# EAGLE design atmega1284_oled_v2 (EAGLE 7.1.0)
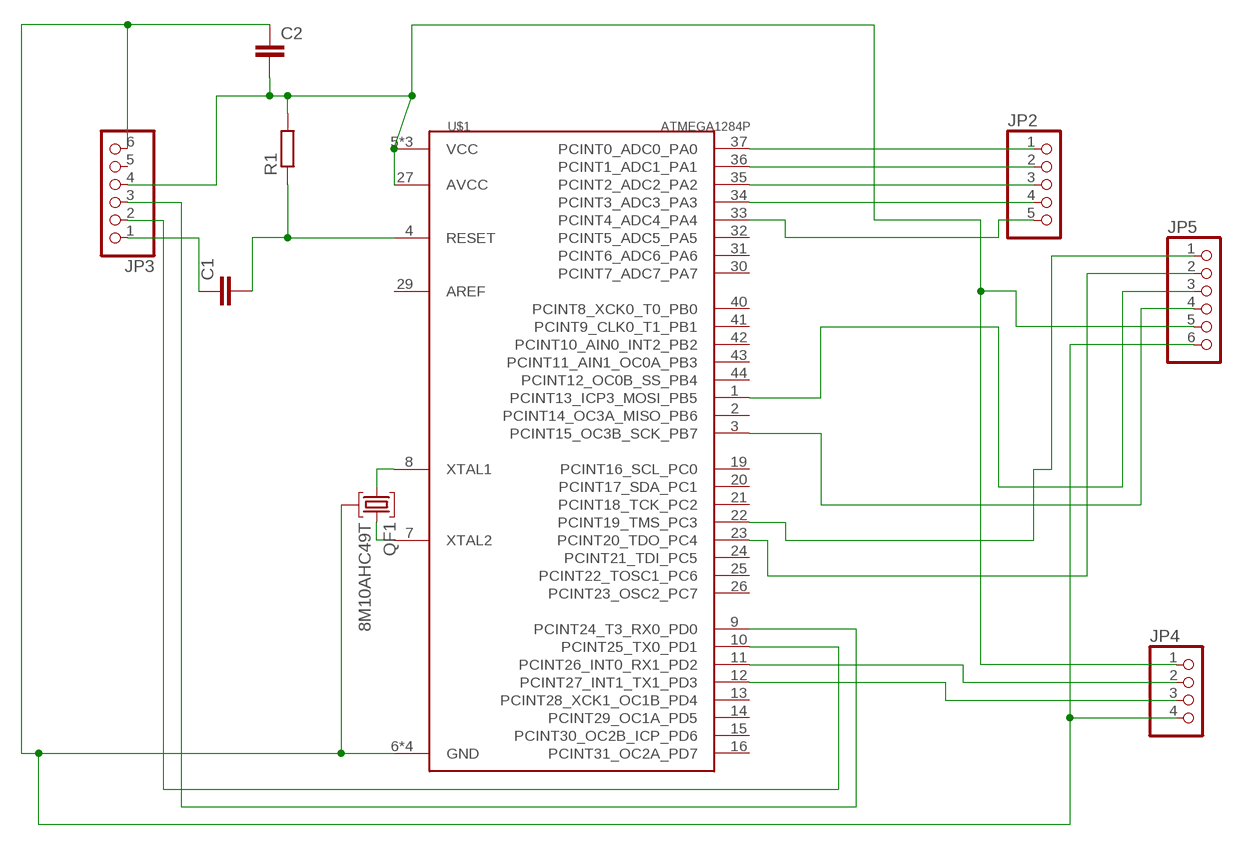
[diagram p0: schematic, sheet 1]

## Parts
C1  C-EUC0805  [C0805]
C2  C-EUC0805  [C0805]
JP2  PINHD-1X5  [1X05]
JP3  PINHD-1X6  [1X06]
JP4  PINHD-1X4  [1X04]
JP5  PINHD-1X6  [1X06]
QF1  8M10AHC49T  [HC49U]
R1  R-EU_R0805  [R0805]
U$1  ATMEGA1284P  [TQFP44]

## Nets
N$1: JP2.1 U$1.37(PCINT0_ADC0_PA0)
N$2: JP2.2 U$1.36(PCINT1_ADC1_PA1)
N$3: JP5.3 U$1.1(PCINT13_ICP3_MOSI_PB5)
N$4: C2.2 JP3.4 JP4.1 JP5.5 R1.2 U$1.5(VCC) U$1.17(VCC) U$1.27(AVCC) U$1.38(VCC)
N$5: QF1.1 U$1.8(XTAL1)
N$6: QF1.3 U$1.7(XTAL2)
N$7: C2.1 JP3.6 JP4.4 JP5.6 QF1.2 U$1.6(GND) U$1.18(GND) U$1.28(GND) U$1.39(GND)
N$8: JP5.4 U$1.3(PCINT15_OC3B_SCK_PB7)
N$9: JP4.2 U$1.11(PCINT26_INT0_RX1_PD2)
N$10: C1.2 R1.1 U$1.4(RESET)
N$11: C1.1 JP3.1
N$12: JP3.2 U$1.10(PCINT25_TX0_PD1)
N$13: JP3.3 U$1.9(PCINT24_T3_RX0_PD0)
N$14: JP5.1 U$1.22(PCINT19_TMS_PC3)
N$15: JP5.2 U$1.23(PCINT20_TDO_PC4)
N$16: JP4.3 U$1.12(PCINT27_INT1_TX1_PD3)
N$17: JP2.3 U$1.35(PCINT2_ADC2_PA2)
N$18: JP2.4 U$1.34(PCINT3_ADC3_PA3)
N$19: JP2.5 U$1.33(PCINT4_ADC4_PA4)
Unconnected: JP3.5 U$1.2(PCINT14_OC3A_MISO_PB6) U$1.13(PCINT28_XCK1_OC1B_PD4) U$1.14(PCINT29_OC1A_PD5) U$1.15(PCINT30_OC2B_ICP_PD6) U$1.16(PCINT31_OC2A_PD7) U$1.19(PCINT16_SCL_PC0) U$1.20(PCINT17_SDA_PC1) U$1.21(PCINT18_TCK_PC2) U$1.24(PCINT21_TDI_PC5) U$1.25(PCINT22_TOSC1_PC6) U$1.26(PCINT23_OSC2_PC7) U$1.29(AREF) U$1.30(PCINT7_ADC7_PA7) U$1.31(PCINT6_ADC6_PA6) U$1.32(PCINT5_ADC5_PA5) U$1.40(PCINT8_XCK0_T0_PB0) U$1.41(PCINT9_CLK0_T1_PB1) U$1.42(PCINT10_AIN0_INT2_PB2) U$1.43(PCINT11_AIN1_OC0A_PB3) U$1.44(PCINT12_OC0B_SS_PB4)

## Library data of the parts
C1 C2 = rcl:C-EU: CAPACITOR, European symbol
JP2 = pinhead:PINHD-1X5: PIN HEADER
JP3 JP5 = pinhead:PINHD-1X6: PIN HEADER
JP4 = pinhead:PINHD-1X4: PIN HEADER
QF1 = crystal:8M10AHC49T: Monolithic Crystal Filters Source: www.vanlong.com; OC_FARNELL: unknown; OC_NEWARK: unknown
R1 = rcl:R-EU_: RESISTOR, European symbol
U$1 = Stephanie_Parts:ATMEGA1284P: My version schematic & footprint for the ATMega1284P TQFP-44 package. Matches digikey part ATMEGA1284P-AU-ND. Tested & working.

## Board
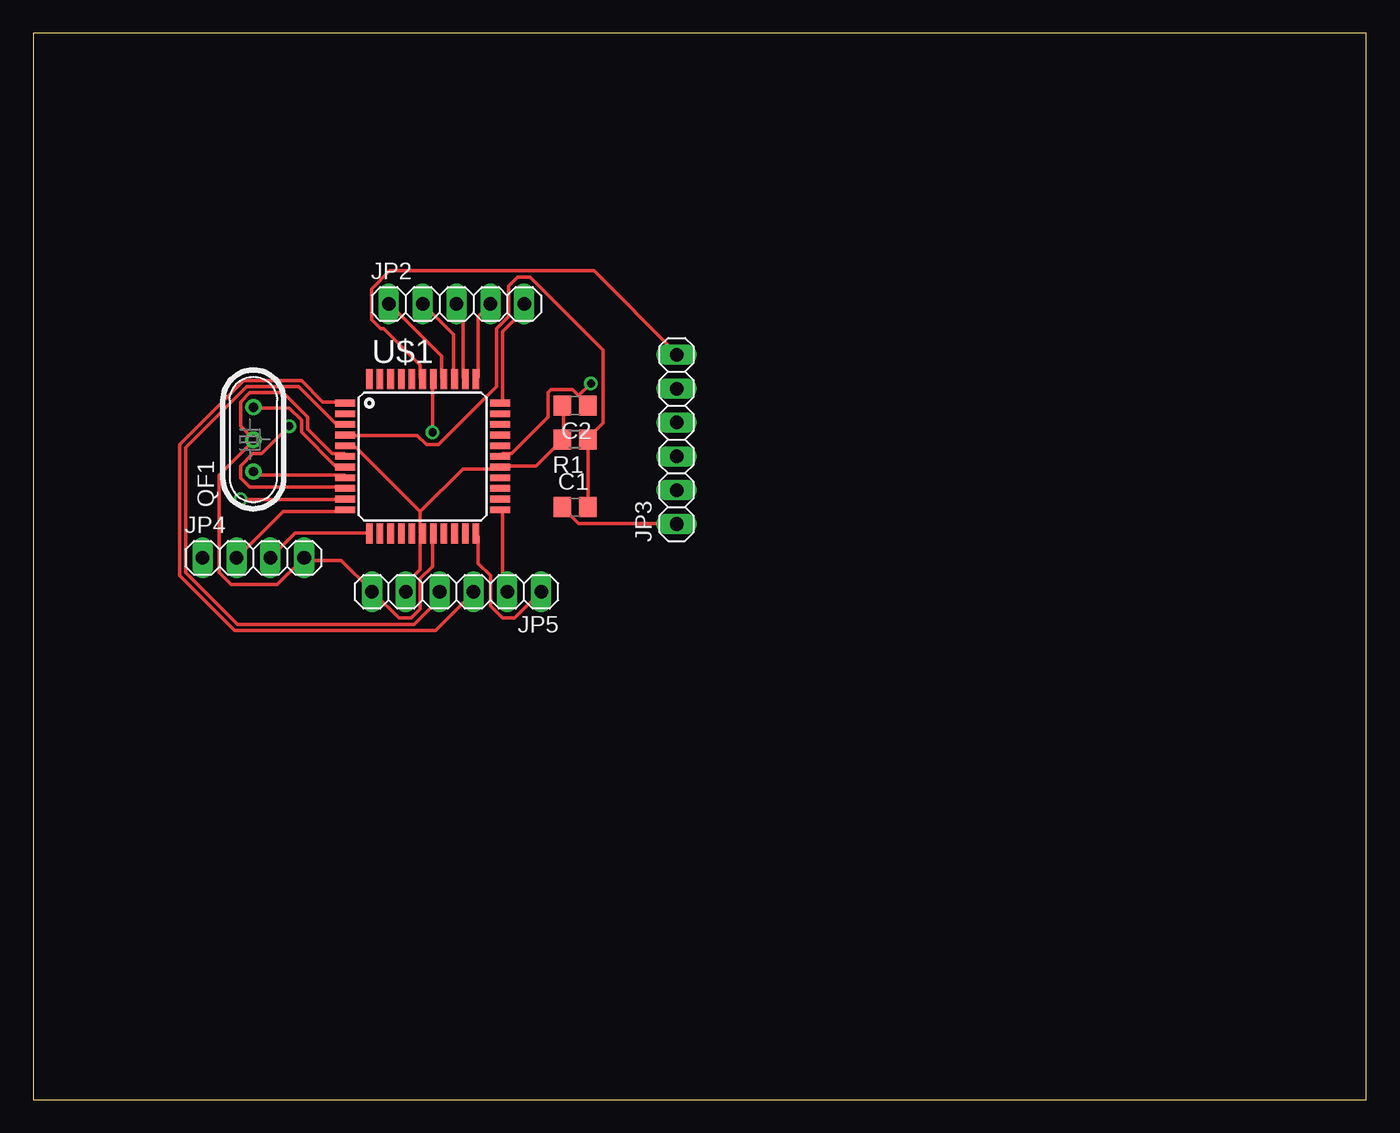
[diagram p1: board, top side]
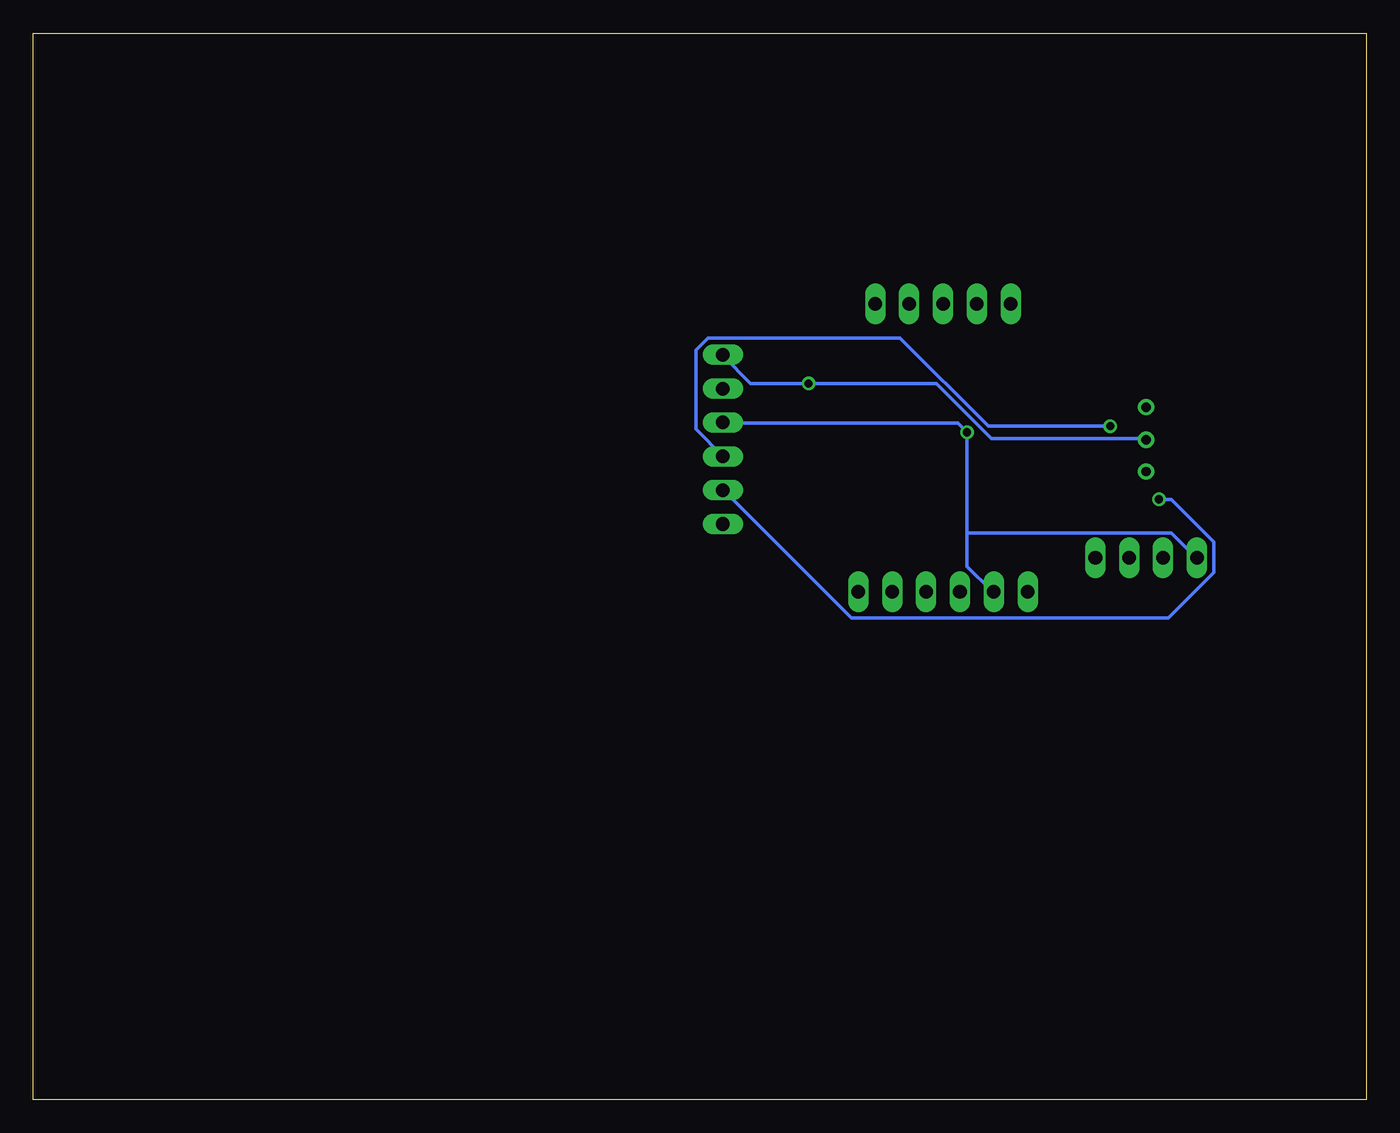
[diagram p2: board, bottom side, seen from below]

Size 100 x 80 mm. Coordinates in mm from the lower left corner, seen from the top.
Outline: 0,0 100,0 100,80 0,80 0,0
Copper layers (1*16): Top 0.035mm / dielectric 1.5mm / Bottom 0.035mm
Design rules "default": minimum track width 10mil, minimum drill 24mil, track to track 8mil, track to pad 8mil, pad to pad 8mil, via to via 8mil, smd to smd 8mil, copper to edge 40mil, drill to drill 8mil, minimum pad ring 10mil, minimum via ring 8mil, stop-mask expansion 4mil, vias tented up to drill 0mil, thermal gap 10mil

### Footprints (pad centres in the part's own frame; a part is rotated, then mirrored left to right if it is on the bottom)
C0805 = smd 1.3 x 1.5: 1 -0.95,0; 2 0.95,0
1X05 = drill 1.016 long: 1 -5.08,0; 2 -2.54,0; 3 0,0; 4 2.54,0; 5 5.08,0
1X06 = drill 1.016 long: 1 -6.35,0; 2 -3.81,0; 3 -1.27,0; 4 1.27,0; 5 3.81,0; 6 6.35,0
1X04 = drill 1.016 long: 1 -3.81,0; 2 -1.27,0; 3 1.27,0; 4 3.81,0
HC49U = drill 0.7 pad 1.2: 1 -2.413,0; 2 -0.027,0; 3 2.413,0
R0805 = smd 1.3 x 1.5: 1 -0.95,0; 2 0.95,0
TQFP44 = smd 1.5 x 0.5: 1 -5.8,4; 2 -5.8,3.2; 3 -5.8,2.4; 4 -5.8,1.6; 5 -5.8,0.8; 6 -5.8,0; 7 -5.8,-0.8; 8 -5.8,-1.6; 9 -5.8,-2.4; 10 -5.8,-3.2; 11 -5.8,-4; 23 5.8,-4; 24 5.8,-3.2; 25 5.8,-2.4; 26 5.8,-1.6; 27 5.8,-0.8; 28 5.8,0; 29 5.8,0.8; 30 5.8,1.6; 31 5.8,2.4; 32 5.8,3.2; 33 5.8,4 | smd 0.5 x 1.5: 12 -4,-5.8; 13 -3.2,-5.8; 14 -2.4,-5.8; 15 -1.6,-5.8; 16 -0.8,-5.8; 17 0,-5.8; 18 0.8,-5.8; 19 1.6,-5.8; 20 2.4,-5.8; 21 3.2,-5.8; 22 4,-5.8; 34 4,5.8; 35 3.2,5.8; 36 2.4,5.8; 37 1.6,5.8; 38 0.8,5.8; 39 0,5.8; 40 -0.8,5.8; 41 -1.6,5.8; 42 -2.4,5.8; 43 -3.2,5.8; 44 -4,5.8

### Placement (x,y rotation side)
C1  40.64,44.45 0 top
C2  40.64,52.07 180 top
JP2  31.75,59.69 0 top
JP3  48.26,49.53 90 top
JP4  16.51,40.64 0 top
JP5  31.75,38.1 180 top
QF1  16.51,49.53 90 top
R1  40.64,49.53 180 top
U$1  29.21,48.26 0 top

### Tracks (layer width: path | path; a pad name or v marks a point on that pad's centre or on a via)
N$1
  Top 0.254: U$1.37 30.63,54.18 30.63,55.78 26.75,59.66 JP2.1
N$2
  Top 0.254: U$1.36 31.55,54.18 31.55,57.38 29.26,59.66 JP2.2
N$3
  Top 0.254: U$1.1 23.32,52.35 21.72,52.35 20.12,53.95 15.77,53.95 10.97,49.15 10.97,39.32 15.09,35.2 30.18,35.2 32.92,37.95 JP5.3
N$4  (via drill 0.61)
  Top 0.254: C2.2 39.78,51.89 39.78,49.61 R1.2 39.55,49.38 37.72,47.55 35.2,47.55 U$1.27 34.98,47.32 32.23,47.32 29.03,44.12 | JP5.5 28.12,38.18 28.12,38.86 29.03,39.78 29.03,42.29 U$1.17 29.03,42.52 29.03,44.12 | 29.03,44.12 24.23,48.92 23.55,48.92 U$1.5 | v29.95,50.06 29.95,53.95 U$1.38
  Bottom 0.254: 29.95,42.52 29.95,40.01 28.12,38.18 JP5.5 | 29.95,42.52 v29.95,50.06 30.63,50.75 48.23,50.75 JP3.4 | 29.95,42.52 14.63,42.52 12.8,40.69 JP4.1
N$5
  Top 0.254: U$1.8 23.32,46.86 16.92,46.86 16.69,47.09 QF1.1
N$6
  Top 0.254: U$1.7 23.32,47.55 22.63,47.55 20.12,50.06 20.12,50.98 19.2,51.89 16.69,51.89 QF1.3
N$7  (via drill 0.61)
  Top 0.254: U$1.6 23.32,48.46 22.4,48.46 20.57,50.29 20.57,51.21 18.75,53.03 16.23,53.03 15.54,52.35 15.54,50.52 16.46,49.61 QF1.2 16.46,49.38 13.95,46.86 13.95,39.55 14.86,38.63 18.29,38.63 20.12,40.46 JP4.4 20.34,40.46 23.09,40.46 25.38,38.18 JP5.6 25.6,37.95 27.43,36.12 28.35,36.12 29.03,36.8 29.03,39.09 29.95,40.01 29.95,42.29 U$1.18 | 40.92,52.81 41.6,52.12 C2.1 | 40.92,52.81 40.46,53.26 38.86,53.26 38.63,53.03 38.63,51.21 35.89,48.46 35.2,48.46 U$1.28 | U$1.39 29.03,54.18 29.03,55.09 26.29,57.84 26.06,57.84 25.38,58.52 25.38,60.81 26.75,62.18 42.06,62.18 48.23,56.01 JP3.6 | v41.83,53.72 40.92,52.81
  Bottom 0.254: JP3.6 48.23,55.78 46.18,53.72 v41.83,53.72 32.23,53.72 28.12,49.61 16.69,49.61 QF1.2
N$8
  Top 0.254: U$1.3 23.32,50.75 22.63,50.75 19.89,53.49 16,53.49 11.43,48.92 11.43,39.55 15.32,35.66 28.57,35.66 30.4,37.49 30.4,37.95 JP5.4
N$9
  Top 0.254: U$1.11 23.32,44.12 18.75,44.12 15.32,40.69 JP4.2
N$10
  Top 0.254: C1.2 41.6,44.58 41.6,49.38 R1.1 41.6,49.61 42.75,50.75 42.75,56.24 37.26,61.72 36.35,61.72 35.66,61.04 35.66,58.75 34.75,57.84 34.75,53.49 30.4,49.15 29.49,49.15 28.8,49.84 23.55,49.84 U$1.4
N$11
  Top 0.254: C1.1 39.78,44.35 40.92,43.2 48.23,43.2 JP3.1
N$12  (via drill 0.61)
  Top 0.254: v15.54,45.03 23.32,45.03 U$1.10
  Bottom 0.254: v15.54,45.03 14.63,45.03 11.43,41.83 11.43,39.55 14.86,36.12 38.63,36.12 48.23,45.72 JP3.2
N$13  (via drill 0.61)
  Top 0.254: v19.2,50.52 17.14,48.46 16.46,48.46 15.54,47.55 15.54,46.63 16.23,45.95 23.32,45.95 U$1.9
  Bottom 0.254: v19.2,50.52 28.35,50.52 34.98,57.15 49.38,57.15 50.29,56.24 50.29,50.29 JP3.3
N$14
  Top 0.254: JP5.1 36.12,36.12 35.2,36.12 34.29,37.03 34.29,39.32 33.38,40.23 33.38,42.29 U$1.22
N$15
  Top 0.254: U$1.23 35.2,44.12 35.2,38.41 35.43,38.18 JP5.2
N$16
  Top 0.254: JP4.3 19.66,42.52 25.15,42.52 U$1.12
N$17
  Top 0.254: JP2.3 32.23,59.21 32.23,54.18 U$1.35
N$18
  Top 0.254: U$1.34 33.38,54.18 33.38,58.75 34.29,59.66 JP2.4
N$19
  Top 0.254: U$1.33 35.2,52.35 35.2,57.61 36.8,59.21 36.8,59.66 JP2.5